# Altium schematic sheet Mechanics.SchDoc: GEM AVD eFuse
size 420 x 297 mm; Author: G.Kasprowicz; CompanyName: WUT ISE; DrawnBy: G.Kasprowicz; Organization: WUT ISE; Address1: PW ISE; Address2: Nowowiejska 15/19 00-665 Warsaw; Address3: gkasprow@gmail.com; Revision: 2; SheetNumber: 5; SheetTotal: 6; ModifiedBy: -; CheckedDate: -; Title2: channel connectors; DivGrp: WUT ISE; Designer: G.Kasprowicz; ModifiedDate: -; ProjectName: Sensor Box
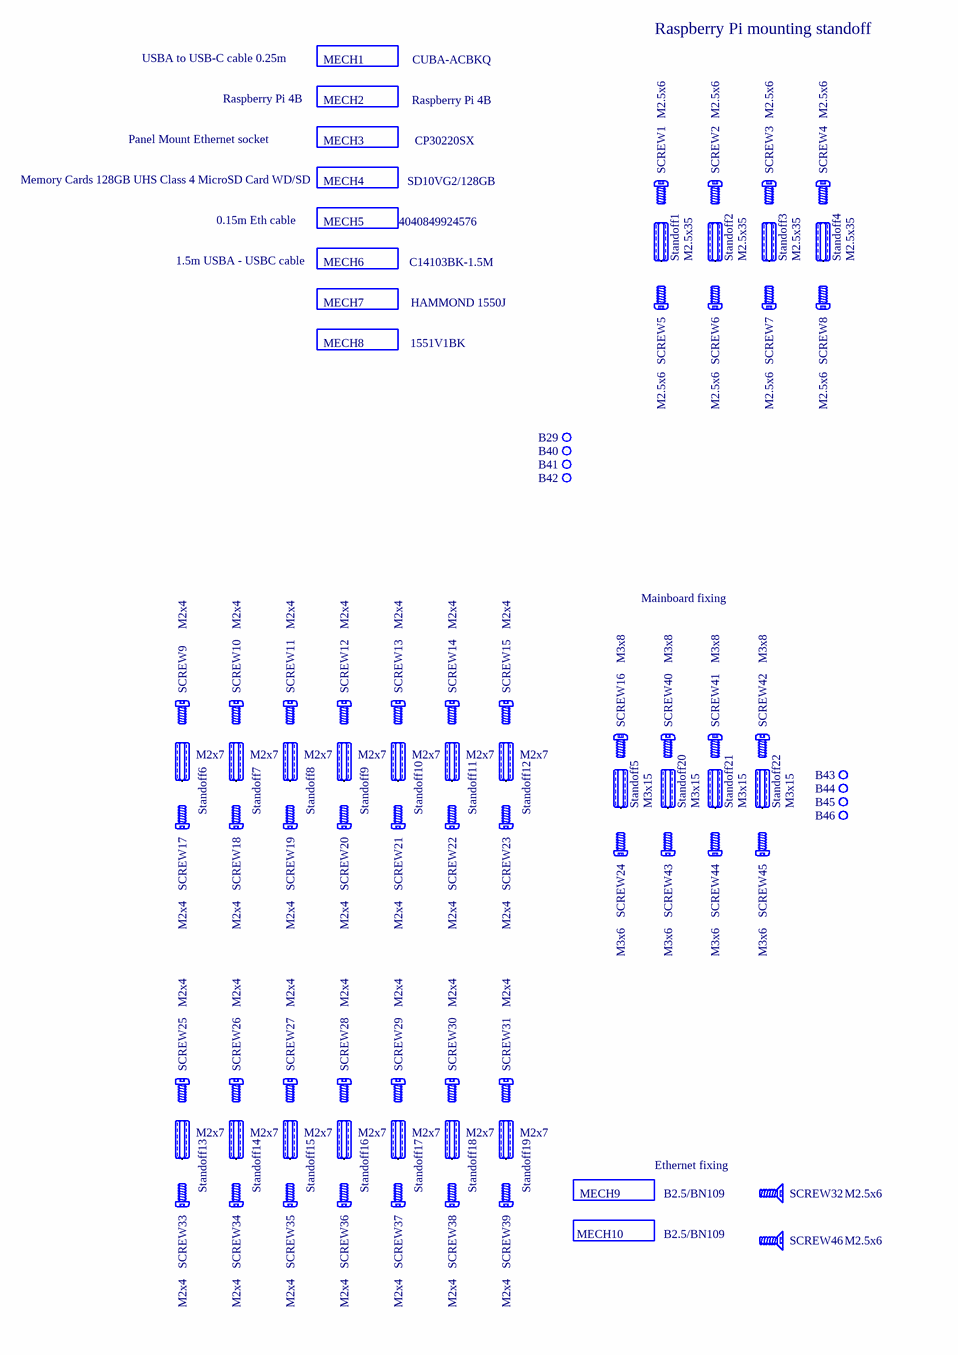
[diagram p0: Mechanics.SchDoc]

## Parts
B29  Plated Hole  [MTG300_600]  (value not drawn)  (no BOM)
B40  Plated Hole  [MTG300_600]  (value not drawn)  (no BOM)
B41  Plated Hole  [MTG300_600]  (value not drawn)  (no BOM)
B42  Plated Hole  [MTG300_600]  (value not drawn)  (no BOM)
B43  Plated Hole  [MTG320_550]  (value not drawn)  (no BOM)
B44  Plated Hole  [MTG320_550]  (value not drawn)  (no BOM)
B45  Plated Hole  [MTG320_550]  (value not drawn)  (no BOM)
B46  Plated Hole  [MTG320_550]  (value not drawn)  (no BOM)
MECH1  CUBA-ACBKQ  (mechanical)
MECH2  Raspberry Pi 4B  (mechanical)
MECH3  CP30220SX  (mechanical)
MECH4  SD10VG2/128GB  (mechanical)
MECH5  4040849924576  (mechanical)
MECH6  C14103BK-1.5M  (mechanical)
MECH7  HAMMOND 1550J  (mechanical)
MECH8  1551V1BK  (mechanical)
MECH9  B2.5/BN109  (mechanical)
MECH10  B2.5/BN109  (mechanical)
SCREW1  M2.5x6  [BOSSARD_BN9524-3271397_h]  (mechanical)
SCREW2  M2.5x6  [BOSSARD_BN9524-3271397_h]  (mechanical)
SCREW3  M2.5x6  [BOSSARD_BN9524-3271397_h]  (mechanical)
SCREW4  M2.5x6  [BOSSARD_BN9524-3271397_h]  (mechanical)
SCREW5  M2.5x6  [BOSSARD_BN9524-3271397_h]  (mechanical)
SCREW6  M2.5x6  [BOSSARD_BN9524-3271397_h]  (mechanical)
SCREW7  M2.5x6  [BOSSARD_BN9524-3271397_h]  (mechanical)
SCREW8  M2.5x6  [BOSSARD_BN9524-3271397_h]  (mechanical)
SCREW9  M2x4  [BOSSARD_BN9524-3271397_h]  (mechanical)
SCREW10  M2x4  [BOSSARD_BN9524-3271397_h]  (mechanical)
SCREW11  M2x4  [BOSSARD_BN9524-3271397_h]  (mechanical)
SCREW12  M2x4  [BOSSARD_BN9524-3271397_h]  (mechanical)
SCREW13  M2x4  [BOSSARD_BN9524-3271397_h]  (mechanical)
SCREW14  M2x4  [BOSSARD_BN9524-3271397_h]  (mechanical)
SCREW15  M2x4  [BOSSARD_BN9524-3271397_h]  (mechanical)
SCREW16  M3x8  [BOSSARD_BN9524-3271397_h]  (mechanical)
SCREW17  M2x4  [BOSSARD_BN9524-3271397_h]  (mechanical)
SCREW18  M2x4  [BOSSARD_BN9524-3271397_h]  (mechanical)
SCREW19  M2x4  [BOSSARD_BN9524-3271397_h]  (mechanical)
SCREW20  M2x4  [BOSSARD_BN9524-3271397_h]  (mechanical)
SCREW21  M2x4  [BOSSARD_BN9524-3271397_h]  (mechanical)
SCREW22  M2x4  [BOSSARD_BN9524-3271397_h]  (mechanical)
SCREW23  M2x4  [BOSSARD_BN9524-3271397_h]  (mechanical)
SCREW24  M3x6  [BOSSARD_BN9524-3271397_h]  (mechanical)
SCREW25  M2x4  [BOSSARD_BN9524-3271397_h]  (mechanical)
SCREW26  M2x4  [BOSSARD_BN9524-3271397_h]  (mechanical)
SCREW27  M2x4  [BOSSARD_BN9524-3271397_h]  (mechanical)
SCREW28  M2x4  [BOSSARD_BN9524-3271397_h]  (mechanical)
SCREW29  M2x4  [BOSSARD_BN9524-3271397_h]  (mechanical)
SCREW30  M2x4  [BOSSARD_BN9524-3271397_h]  (mechanical)
SCREW31  M2x4  [BOSSARD_BN9524-3271397_h]  (mechanical)
SCREW32  M2.5x6  [OSSARD_M3X8/BN3327_h]  (mechanical)
SCREW33  M2x4  [BOSSARD_BN9524-3271397_h]  (mechanical)
SCREW34  M2x4  [BOSSARD_BN9524-3271397_h]  (mechanical)
SCREW35  M2x4  [BOSSARD_BN9524-3271397_h]  (mechanical)
SCREW36  M2x4  [BOSSARD_BN9524-3271397_h]  (mechanical)
SCREW37  M2x4  [BOSSARD_BN9524-3271397_h]  (mechanical)
SCREW38  M2x4  [BOSSARD_BN9524-3271397_h]  (mechanical)
SCREW39  M2x4  [BOSSARD_BN9524-3271397_h]  (mechanical)
SCREW40  M3x8  [BOSSARD_BN9524-3271397_h]  (mechanical)
SCREW41  M3x8  [BOSSARD_BN9524-3271397_h]  (mechanical)
SCREW42  M3x8  [BOSSARD_BN9524-3271397_h]  (mechanical)
SCREW43  M3x6  [BOSSARD_BN9524-3271397_h]  (mechanical)
SCREW44  M3x6  [BOSSARD_BN9524-3271397_h]  (mechanical)
SCREW45  M3x6  [BOSSARD_BN9524-3271397_h]  (mechanical)
SCREW46  M2.5x6  [OSSARD_M3X8/BN3327_h]  (mechanical)
Standoff1  M2.5x35  [BOSSARD_BN3320-1382721]  (mechanical)
Standoff2  M2.5x35  [BOSSARD_BN3320-1382721]  (mechanical)
Standoff3  M2.5x35  [BOSSARD_BN3320-1382721]  (mechanical)
Standoff4  M2.5x35  [BOSSARD_BN3320-1382721]  (mechanical)
Standoff5  M3x15  [BOSSARD_BN3320-1382721]  (mechanical)
Standoff6  M2x7  [BOSSARD_BN3320-1382721]  (mechanical)
Standoff7  M2x7  [BOSSARD_BN3320-1382721]  (mechanical)
Standoff8  M2x7  [BOSSARD_BN3320-1382721]  (mechanical)
Standoff9  M2x7  [BOSSARD_BN3320-1382721]  (mechanical)
Standoff10  M2x7  [BOSSARD_BN3320-1382721]  (mechanical)
Standoff11  M2x7  [BOSSARD_BN3320-1382721]  (mechanical)
Standoff12  M2x7  [BOSSARD_BN3320-1382721]  (mechanical)
Standoff13  M2x7  [BOSSARD_BN3320-1382721]  (mechanical)
Standoff14  M2x7  [BOSSARD_BN3320-1382721]  (mechanical)
Standoff15  M2x7  [BOSSARD_BN3320-1382721]  (mechanical)
Standoff16  M2x7  [BOSSARD_BN3320-1382721]  (mechanical)
Standoff17  M2x7  [BOSSARD_BN3320-1382721]  (mechanical)
Standoff18  M2x7  [BOSSARD_BN3320-1382721]  (mechanical)
Standoff19  M2x7  [BOSSARD_BN3320-1382721]  (mechanical)
Standoff20  M3x15  [BOSSARD_BN3320-1382721]  (mechanical)
Standoff21  M3x15  [BOSSARD_BN3320-1382721]  (mechanical)
Standoff22  M3x15  [BOSSARD_BN3320-1382721]  (mechanical)

## Nets

Not connected (* = marked no-connect by the designer): B29 1; B40 1; B41 1; B42 1; B43 1; B44 1; B45 1; B46 1; Standoff1 1; Standoff2 1; Standoff3 1; Standoff4 1; Standoff5 1; Standoff6 1; Standoff7 1; Standoff8 1; Standoff9 1; Standoff10 1; Standoff11 1; Standoff12 1; Standoff13 1; Standoff14 1; Standoff15 1; Standoff16 1; Standoff17 1; Standoff18 1; Standoff19 1; Standoff20 1; Standoff21 1; Standoff22 1

## Notes on the sheet
- Raspberry Pi mounting standoff
- Mainboard fixing
- Ethernet fixing
- Project/Equipment
- Document
- Designer
- Drawn by
- Check.by
- Copyright WUT ISE 2020.
  This documentation describes Open Hardware and is licensed under the CERN OHL v.1.2. You may redistribute and modify this documentation under the terms of the CERN OHL v.1.2. (http://ohwr.org/CERNOHL). This documentation is distributed WITHOUT ANY EXPRESS OR IMPLIED WARRANTY, INCLUDING OF MERCHANTABILITY, SATISFACTORY QUALITY AND FITNESS FOR A PARTICULAR PURPOSE. Please see the CERN OHL v.1.2 for applicable conditions.
- Contact
- File
- Last Mod.
- Print Date
- Sheet
- Size
- A3
- of
- Rev

## Library data of the parts
B29 B40-B42 = PLATED_HOLE3.0_PAD6.0: Single Terminal Socket; Part Description: Plated Through Hole: Hole Dia.=3.0mm Pad Dia.=6.0mm; Mounted: No; Part Number: PLATED_HOLE3.0_PAD6.0; Component Type: Standard (No BOM); Pin Count: 1; Family: Plated Hole; Socket: No; SMD: No; Sense: No; Status: None; ComponentHeight: 0mm; HelpURL: Undefined; Author: CERN DEM JLC; CreateDate: 26.05.2008; LatestRevisionDate: 26.05.2008; PackageDescription: Plated Through Hole: Hole Dia.=3.0mm Pad Dia.=6.0mm
B43-B46 = PLATED_HOLE3.2_PAD5.5: Single Terminal Socket; Part Description: Plated Through Hole: Hole Dia.=3.2mm Pad Dia.=5.5mm; Mounted: No; Part Number: PLATED_HOLE3.2_PAD5.5; Component Type: Standard (No BOM); Pin Count: 1; Family: Plated Hole; Socket: No; SMD: No; Sense: No; Status: None; ComponentHeight: 0mm; HelpURL: Undefined; Author: CERN DEM JMW; CreateDate: 01.10.2012; LatestRevisionDate: 01.10.2012; PackageDescription: Plated Through Hole: Hole Dia.=3.2mm Pad Dia.=5.5mm
MECH1 = Generic_mechanical: USBA to USB-C cable 0.25m; Manufacturer: Lanberg; PressFit: No; Part Number: CUBA-ACBKQ; Component Type: Standard; Footprint: generic_MECH; Pin Count: 0; PackageDescription: generic; Mounted: Yes; Socket: No; SMD: No; Sense: No; Status: None; Part Description: USBA to USB-C cable 0.25m; Manufacturer Part Number: CUBA-ACBKQ; ComponentHeight: generic; Author: FS; CreateDate: 28.10.2019; LatestRevisionDate: 28.10.2019
MECH2 MECH7 = Generic_mechanical: PressFit: No; Component Type: Standard; Footprint: generic_MECH; Pin Count: 0; PackageDescription: generic; Mounted: Yes; Socket: No; SMD: No; Sense: No; Status: None; ComponentHeight: generic; CreateDate: 28.10.2019; LatestRevisionDate: 28.10.2019
  MECH2: Part Number: Raspberry Pi 4B; Part Description: Raspberry Pi 4B; Manufacturer: Raspberry Pi 4B; Manufacturer Part Number: Raspberry Pi 4B; Author: FS
  MECH7: Part Number: HAMMOND 1550J; Part Description: HAMMOND 1550J; Manufacturer: HAMMOND; Manufacturer Part Number: HAMMOND 1550J; Author: GK
MECH3 = Generic_mechanical: Panel Mount Ethernet socket; Manufacturer: CLIFF; PressFit: No; Part Number: CP30220SX; Component Type: Standard; Footprint: generic_MECH; Pin Count: 0; PackageDescription: generic; Mounted: Yes; Socket: No; SMD: No; Sense: No; Status: None; Part Description: Panel Mount Ethernet socket; Manufacturer Part Number: CP30220SX; ComponentHeight: generic; Author: FS; CreateDate: 28.10.2019; LatestRevisionDate: 28.10.2019
MECH4 = Generic_mechanical: Memory Cards 128GB UHS Class 4 MicroSD Card WD/SD; Manufacturer: Kingston; PressFit: No; Part Number: SD10VG2/128GB; Component Type: Standard; Footprint: generic_MECH; Pin Count: 0; PackageDescription: generic; Mounted: Yes; Socket: No; SMD: No; Sense: No; Status: None; Part Description: Memory Cards 128GB UHS Class 4 MicroSD Card WD/SD; Manufacturer Part Number: SD10VG2/128GB; ComponentHeight: generic; Author: FS; CreateDate: 28.10.2019; LatestRevisionDate: 28.10.2019
MECH5 = Generic_mechanical: 0.15m Eth cable; Manufacturer: Goobay; PressFit: No; Part Number: 4040849924576; Component Type: Standard; Footprint: generic_MECH; Pin Count: 0; PackageDescription: generic; Mounted: Yes; Socket: No; SMD: No; Sense: No; Status: None; Part Description: 0.15m Eth cable; Manufacturer Part Number: 4040849924576; ComponentHeight: generic; Author: FS; CreateDate: 28.10.2019; LatestRevisionDate: 28.10.2019
MECH6 = Generic_mechanical: 1.5m USBA - USBC cable; Manufacturer: Unitek; PressFit: No; Part Number: C14103BK-1.5M; Component Type: Standard; Footprint: generic_MECH; Pin Count: 0; PackageDescription: generic; Mounted: Yes; Socket: No; SMD: No; Sense: No; Status: None; Part Description: 1.5m USBA - USBC cable; Manufacturer Part Number: C14103BK-1.5M; ComponentHeight: generic; Author: FS; CreateDate: 28.10.2019; LatestRevisionDate: 28.10.2019
MECH8 = Generic_mechanical: Manufacturer: Hammond; PressFit: No; Value: 750mm; Part Number: 1551V1BK; Component Type: Standard; Footprint: generic_MECH; Pin Count: 0; PackageDescription: generic; Mounted: Yes; Socket: No; SMD: No; Sense: No; Status: None; Part Description: 1551V1BK; Manufacturer Part Number: 1551V1BK; ComponentHeight: generic; Author: GK; CreateDate: 28.10.2019; LatestRevisionDate: 28.10.2019
MECH9 MECH10 = Generic_mechanical: M2.5 NUT; Manufacturer: Bosard; PressFit: No; Value: 750mm; Part Number: B2.5/BN109; Component Type: Standard; Footprint: generic_MECH; Pin Count: 0; PackageDescription: generic; Mounted: Yes; Socket: No; SMD: No; Sense: No; Status: None; Part Description: B2.5/BN109; Manufacturer Part Number: B2.5/BN109; ComponentHeight: generic; Author: GK; CreateDate: 28.10.2019; LatestRevisionDate: 28.10.2019
SCREW1-SCREW8 = BOSSARD_BN9524-3271397_h: Screw; Part Number: 8G206M2X04; Part Description: M2.5 L=6mm; Manufacturer: DREMEC; Manufacturer Part Number: DR8G201M2.5X6; PressFit: No; Component Type: Mechanical; Pin Count: 0; PackageDescription: M2.5 L=6mm; Mounted: Yes; Socket: No; SMD: No; Sense: No; Status: None; Value: M2.5x6; ComponentHeight: 6mm; HelpURL: \\cern.ch\dfs\Applications\Altium\Datasheets\BOSSARD_BN9524-3271397.pdf; Author: CERN DEM JLC; CreateDate: 11.03.2019; LatestRevisionDate: 11.03.2019
SCREW9-SCREW15 SCREW17-SCREW23 SCREW25-SCREW31 SCREW33-SCREW39 = BOSSARD_BN9524-3271397_h: Screw; Part Number: 8G206M2X04; Part Description: M2 L=4mm; Manufacturer: DREMEC; PressFit: No; Component Type: Mechanical; Pin Count: 0; PackageDescription: M2 L=4mm; Mounted: Yes; Socket: No; SMD: No; Sense: No; Status: None; Value: M2x4; Manufacturer Part Number: 8G206M2X04; ComponentHeight: 6mm; HelpURL: \\cern.ch\dfs\Applications\Altium\Datasheets\BOSSARD_BN9524-3271397.pdf; Author: CERN DEM JLC; CreateDate: 11.03.2019; LatestRevisionDate: 11.03.2019
SCREW16 SCREW40-SCREW42 = BOSSARD_BN9524-3271397_h: Screw M3 poiliamid 8mm; Part Number: DR8G201M3X8; Part Description: M3 L=8mm; Manufacturer: DREMEC; PressFit: No; Component Type: Mechanical; Pin Count: 0; PackageDescription: M3 L=8mm; Mounted: Yes; Socket: No; SMD: No; Sense: No; Status: None; Value: M3x8; Manufacturer Part Number: DR8G201M3X8; ComponentHeight: 8; HelpURL: \\cern.ch\dfs\Applications\Altium\Datasheets\BOSSARD_BN9524-3271397.pdf; Author: CERN DEM JLC; CreateDate: 11.03.2019; LatestRevisionDate: 11.03.2019
SCREW24 SCREW43-SCREW45 = BOSSARD_BN9524-3271397_h: Screw M3 countersink 6mm; Part Number: B3X6/BN388; Part Description: M3 L=6mm; Manufacturer: DREMEC; PressFit: No; Component Type: Mechanical; Pin Count: 0; PackageDescription: M3 L=6mm; Mounted: Yes; Socket: No; SMD: No; Sense: No; Status: None; Value: M3x6; Manufacturer Part Number: B3X6/BN388; ComponentHeight: 6mm; HelpURL: \\cern.ch\dfs\Applications\Altium\Datasheets\BOSSARD_BN9524-3271397.pdf; Author: CERN DEM JLC; CreateDate: 11.03.2019; LatestRevisionDate: 11.03.2019
SCREW32 SCREW46 = OSSARD_M3X8/BN3327: Screw; 3x8; Head: countersunk; Pozidriv; A2 stainless steel; Part Number: B2.5X6/BN388; Part Description: M2.5 L=6mm  countersunk; Pozidriv Pan Head Screw, Fully Threaded, Stainless Steel A2; Manufacturer: BOSSARD; PressFit: No; Component Type: Mechanical; Pin Count: 0; PackageDescription: M2.5 L=6mm Countersunk Posidriv Screw, Fully Threaded - Stainless Steel A2; Mounted: Yes; Socket: No; SMD: No; Sense: No; Status: None; Value: M2.5x6; Manufacturer Part Number: B2.5X6/BN388; ComponentHeight: 5.6mm; HelpURL: \\cern.ch\dfs\Applications\Altium\Datasheets\BOSSARD_BN5687-3061605.pdf; Author: GK; CreateDate: 15/01/2013; LatestRevisionDate: 15/01/2013
Standoff1-Standoff4 = BOSSARD_BN3320-1382721: Standoff Female-Female 15mm; Part Number: TFF-M2.5X35/DR182; Part Description: M2.5 L=35mm, Hex Stand-Off; Manufacturer: DREMEC; PressFit: No; Component Type: Mechanical; Footprint: BOSSARD_BN3320-1544624; Pin Count: 1; PackageDescription: M2.5 L=35mm, Hex Stand-Off with Internal Thread; Mounted: Yes; Socket: No; SMD: No; Sense: No; Status: None; Value: M2.5x35; Manufacturer Part Number: TFF-M2.5X35/DR182; ComponentHeight: 35mm; HelpURL: \\cern.ch\dfs\Applications\Altium\Datasheets\BOSSARD_BN3320-1382721.pdf; Author: CERN DEM BC; CreateDate: 25.09.2020; LatestRevisionDate: 25.09.2020
Standoff5 Standoff20-Standoff22 = BOSSARD_BN3320-1382721: Standoff Female-Female 15mm; Part Number: R30-1611500; Part Description: M3 L=15mm, Hex Stand-Off; Manufacturer: HARWIN; PressFit: No; Component Type: Mechanical; Footprint: BOSSARD_BN3320-1544624; Pin Count: 1; PackageDescription: M3 L=15mm, Hex Stand-Off with Internal Thread; Mounted: Yes; Socket: No; SMD: No; Sense: No; Status: None; Value: M3x15; Manufacturer Part Number: R30-1611500; ComponentHeight: 15mm; HelpURL: \\cern.ch\dfs\Applications\Altium\Datasheets\BOSSARD_BN3320-1382721.pdf; Author: CERN DEM BC; CreateDate: 25.09.2020; LatestRevisionDate: 25.09.2020
Standoff6-Standoff19 = BOSSARD_BN3320-1382721: Standoff Female-Female; Part Number: FIX-HP2-7; Part Description: M2 L=7mm; PressFit: No; Component Type: Mechanical; Pin Count: 1; PackageDescription: M2 L=17mm; Mounted: Yes; Socket: No; SMD: No; Sense: No; Status: None; Value: M2x7; Manufacturer: BOSSARD; Manufacturer Part Number: FIX-HP2-7; ComponentHeight: 12mm; HelpURL: \\cern.ch\dfs\Applications\Altium\Datasheets\BOSSARD_BN3320-1382721.pdf; Author: CERN DEM BC; CreateDate: 25.09.2020; LatestRevisionDate: 25.09.2020